# Altium schematic sheet MCU_PCL.SchDoc
size A4; SheetNumber: 1; SheetTotal: 9
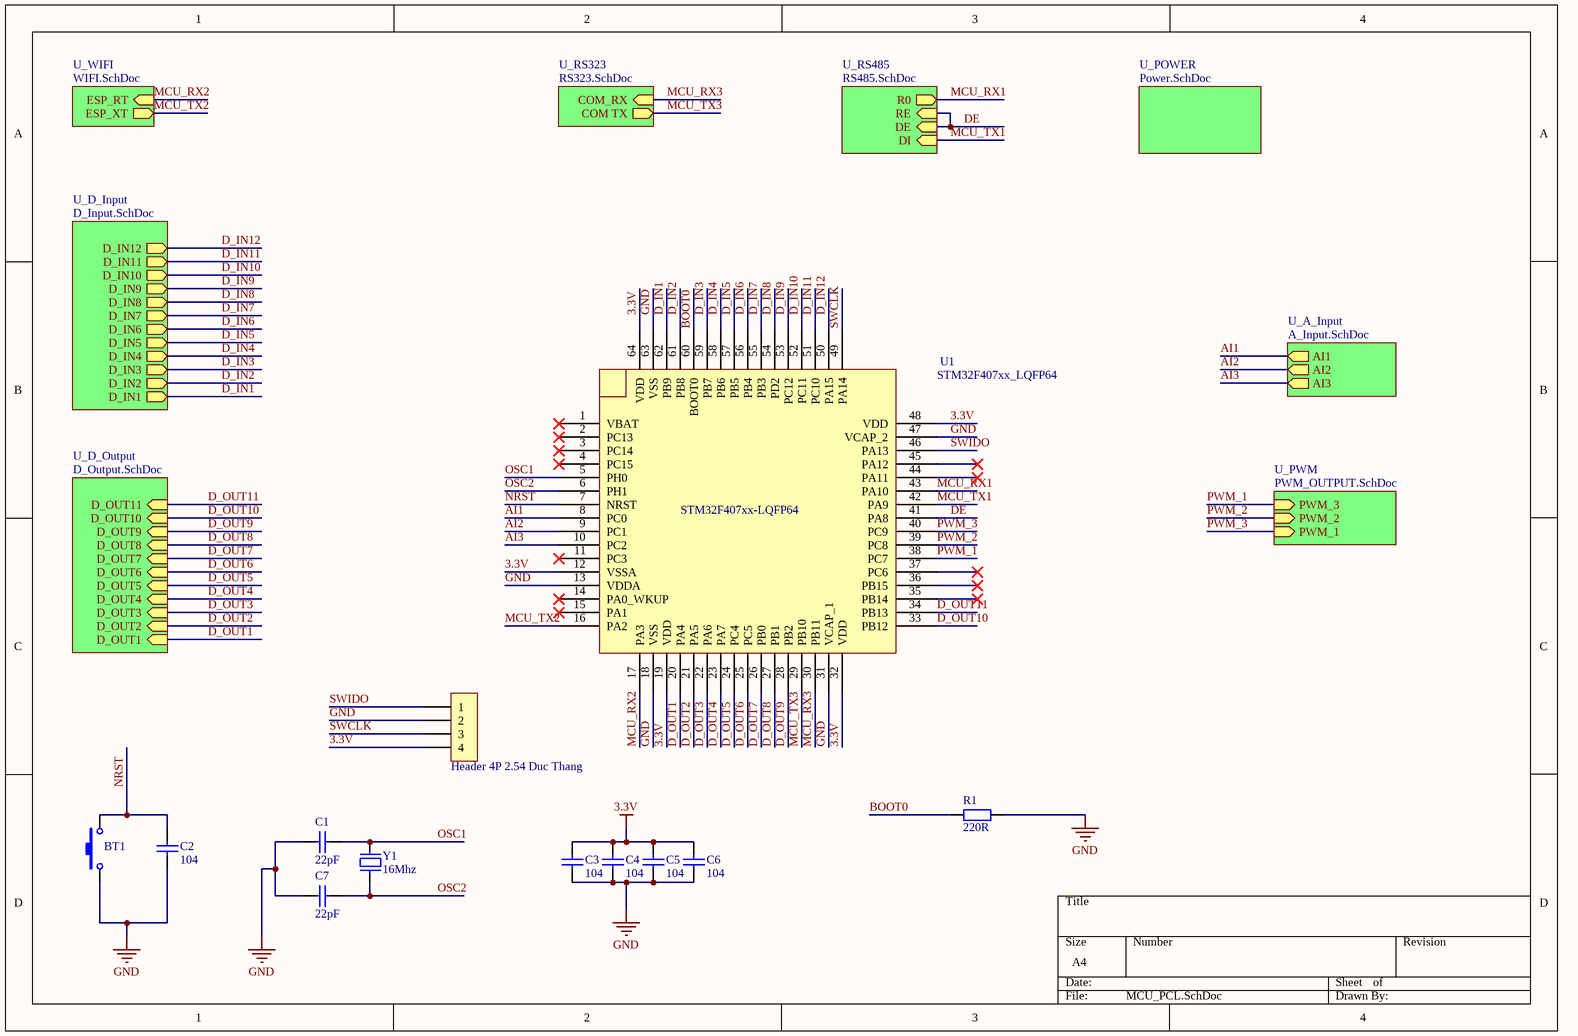
[diagram p0: MCU_PCL.SchDoc]

## Parts
BT1  Nut Nhan 2 Chan SMD 3x6x2.5  [Nut Nhan 2 Chan SMD 3x6x2.5]  (value not drawn)
C1  22pF  [tu 0805]
C2  104  [tu 0603]
C3  104  [tu 0603]
C4  104  [tu 0603]
C5  104  [tu 0603]
C6  104  [tu 0603]
C7  22pF  [tu 0805]
H1  Header 4P 2.54 Duc Thang  [XH2.54M-4]
R1  220R  [tro smd 0603]
U1  STM32F407xx_LQFP64  [STM32_LQFP64]
Y1  16Mhz  [Thach Anh 2 chan SMD]

## Sub-sheets
U_A_Input = A_Input.SchDoc: AI3 (out), AI1 (out), AI2 (out)
U_D_Input = D_Input.SchDoc: D_IN4 (out), D_IN9 (out), D_IN11 (out), D_IN5 (out), D_IN7 (out), D_IN12 (out), D_IN6 (out), D_IN10 (out), D_IN2 (out), D_IN8 (out), D_IN3 (out), D_IN1 (out)
U_D_Output = D_Output.SchDoc: D_OUT2 (in), D_OUT1 (in), D_OUT3 (in), D_OUT8 (in), D_OUT5 (in), D_OUT11 (in), D_OUT10 (in), D_OUT9 (in), D_OUT6 (in), D_OUT7 (in), D_OUT4 (in)
U_POWER = Power.SchDoc: no entries
U_PWM = PWM_OUTPUT.SchDoc: PWM_3 (in), PWM_2 (in), PWM_1 (in)
U_RS323 = RS323.SchDoc: COM_RX (in), COM TX (out)
U_RS485 = RS485.SchDoc: R0 (out), DE (in), DI (in), RE (in)
U_WIFI = WIFI.SchDoc: ESP_RT (in), ESP_XT (out)

## Nets
3.3V: C3.1 C4.1 C5.1 C6.1 H1.4 U1.12(VSSA) U1.19(VDD) U1.32(VDD) U1.48(VDD) U1.64(VDD)
GND: BT1.1 C1.1 C2.2 C3.2 C4.2 C5.2 C6.2 C7.1 H1.2 R1.2 U1.13(VDDA) U1.18(VSS) U1.31(VCAP_1) U1.47(VCAP_2) U1.63(VSS)
AI1: U1.8(PC0) ; sheet U_A_Input/AI1
AI2: U1.9(PC1) ; sheet U_A_Input/AI2
AI3: U1.10(PC2) ; sheet U_A_Input/AI3
BOOT0: R1.1 U1.60(BOOT0)
D_IN1: U1.62(PB9) ; sheet U_D_Input/D_IN1
D_IN2: U1.61(PB8) ; sheet U_D_Input/D_IN2
D_IN3: U1.59(PB7) ; sheet U_D_Input/D_IN3
D_IN4: U1.58(PB6) ; sheet U_D_Input/D_IN4
D_IN5: U1.57(PB5) ; sheet U_D_Input/D_IN5
D_IN6: U1.56(PB4) ; sheet U_D_Input/D_IN6
D_IN7: U1.55(PB3) ; sheet U_D_Input/D_IN7
D_IN8: U1.54(PD2) ; sheet U_D_Input/D_IN8
D_IN9: U1.53(PC12) ; sheet U_D_Input/D_IN9
D_IN10: U1.52(PC11) ; sheet U_D_Input/D_IN10
D_IN11: U1.51(PC10) ; sheet U_D_Input/D_IN11
D_IN12: U1.50(PA15) ; sheet U_D_Input/D_IN12
D_OUT1: U1.20(PA4) ; sheet U_D_Output/D_OUT1
D_OUT2: U1.21(PA5) ; sheet U_D_Output/D_OUT2
D_OUT3: U1.22(PA6) ; sheet U_D_Output/D_OUT3
D_OUT4: U1.23(PA7) ; sheet U_D_Output/D_OUT4
D_OUT5: U1.24(PC4) ; sheet U_D_Output/D_OUT5
D_OUT6: U1.25(PC5) ; sheet U_D_Output/D_OUT6
D_OUT7: U1.26(PB0) ; sheet U_D_Output/D_OUT7
D_OUT8: U1.27(PB1) ; sheet U_D_Output/D_OUT8
D_OUT9: U1.28(PB2) ; sheet U_D_Output/D_OUT9
D_OUT10: U1.33(PB12) ; sheet U_D_Output/D_OUT10
D_OUT11: U1.34(PB13) ; sheet U_D_Output/D_OUT11
DE: U1.41(PA8) ; sheet U_RS485/DE, sheet U_RS485/RE
MCU_RX1: U1.43(PA10) ; sheet U_RS485/R0
MCU_RX2: U1.17(PA3) ; sheet U_WIFI/ESP_RT
MCU_RX3: U1.30(PB11) ; sheet U_RS323/COM_RX
MCU_TX1: U1.42(PA9) ; sheet U_RS485/DI
MCU_TX2: U1.16(PA2) ; sheet U_WIFI/ESP_XT
MCU_TX3: U1.29(PB10) ; sheet U_RS323/COM TX
NRST: BT1.2 C2.1 U1.7(NRST)
OSC1: C1.2 U1.5(PH0) Y1.2
OSC2: C7.2 U1.6(PH1) Y1.1
PWM_1: U1.38(PC7) ; sheet U_PWM/PWM_3
PWM_2: U1.39(PC8) ; sheet U_PWM/PWM_2
PWM_3: U1.40(PC9) ; sheet U_PWM/PWM_1
SWCLK: H1.3 U1.49(PA14)
SWIDO: H1.1 U1.46(PA13)

Not connected (* = marked no-connect by the designer): U1 1(VBAT)* 2(PC13)* 3(PC14)* 4(PC15)* 11(PC3)* 14(PA0_WKUP)* 15(PA1)* 35(PB14)* 36(PB15)* 37(PC6)* 44(PA11)* 45(PA12)*

## Notes on the sheet
- (in symbol STM32F407xx_LQFP64) STM32F407xx-LQFP64

## Library data of the parts
BT1 = Nut Nhan 2 Chan SMD 3x6x2.5: Ma_Hang: MH001036; Ten: Nút Nhấn 2 Chân 3x6x2.5MM SMD
C1 C7 = Tu 0805 22pF 50V 10%: Dán; Don_Vi: Con; So_Chan: 2; Ten_Linh_Kien: Tụ 0805 22P 10% 50V; Ma_Hang: MH004560; Chung_Loai: Dán; Kieu_Chan: *
C2-C6 = Tu 0603 104 50V 10%: Dán; Don_Vi: Con; So_Chan: 2; Ten_Linh_Kien: Tụ 0603 104-100nF 10% 50V; Ma_Hang: MH004568; Chung_Loai: Dán; Kieu_Chan: *
H1 = Header 4P 2.54 Duc Thang: Cắm; Ten_Linh_Kien: Header 4P XH2.54-4P Đực Thẳng; Don_Vi: Con; Ma_Hang: MH001285; Chung_Loai: Cắm
R1 = Tro 0603 5% 220R: Dán; Don_Vi: Con; So_Chan: 2; Ten_Linh_Kien: Trở 0603 5% 220R; Ma_Hang: MH006322; Chung_Loai: Dán; Kieu_Chan: *
Y1 = Thach Anh 2 chan SMD: Crystal For all Crystal 2pin.; Value: 4Mhz